# Altium project DCLASS.PrjPcb
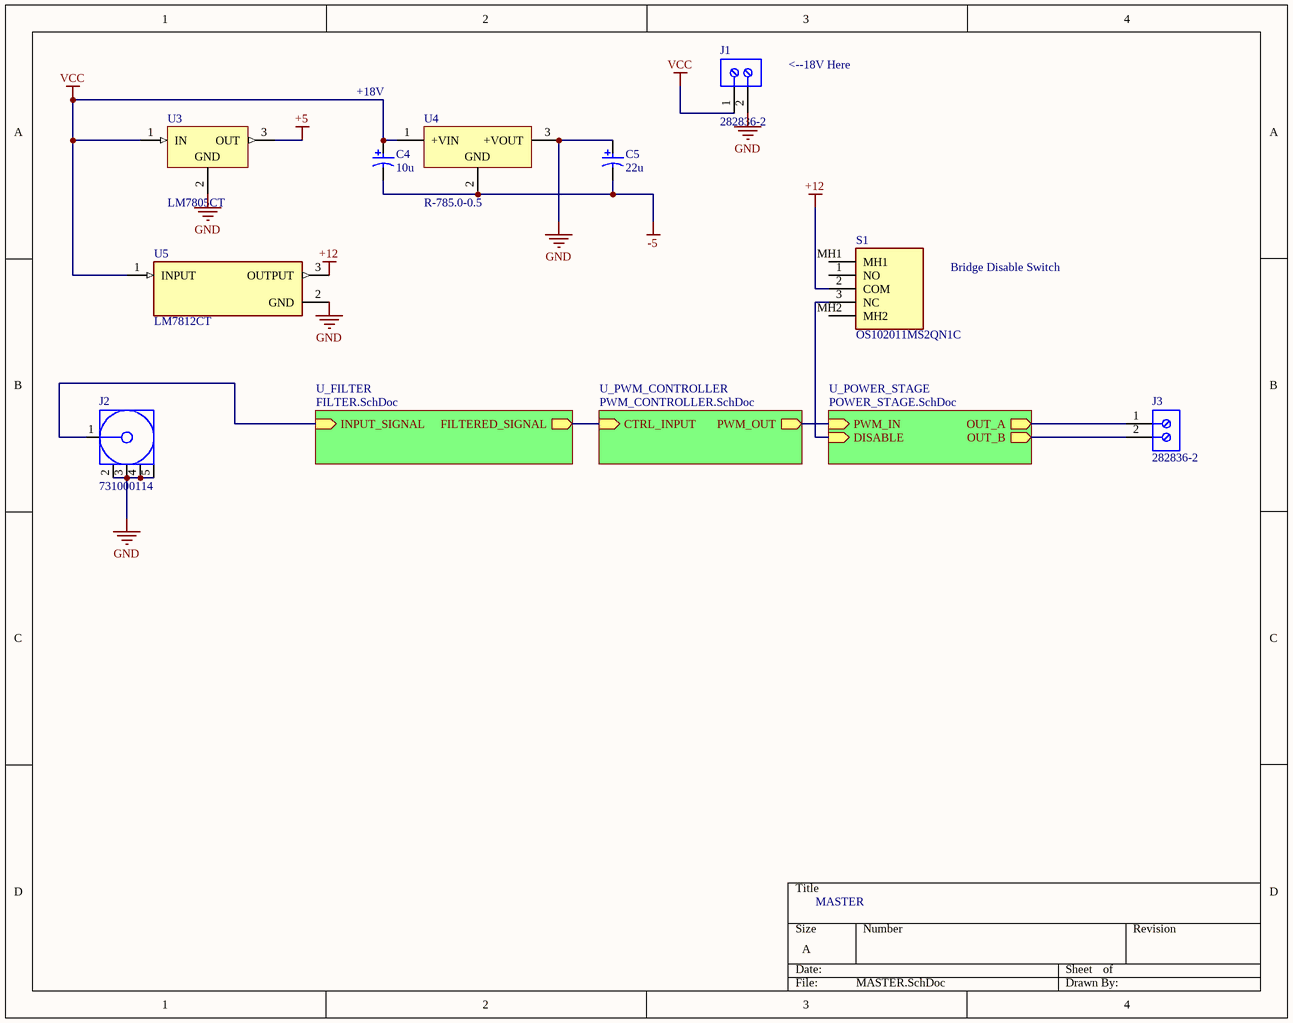
[diagram p0: MASTER.SchDoc]
4 sheets, 52 parts. Net scope: hierarchical (ports join the sheet entries above them; power ports are global).
Sheets:
  MASTER.SchDoc
    U_PWM_CONTROLLER = PWM_CONTROLLER.SchDoc
    U_FILTER = FILTER.SchDoc
    U_POWER_STAGE = POWER_STAGE.SchDoc

## Sheet MASTER.SchDoc: MASTER
size A; Author: Keshav Raj, Tim Loretto; DocumentNumber: 1; Revision: 1.0; SheetNumber: 1; SheetTotal: 4

### Parts
C4  10u  [PNSC-ECA-1VM221-2]
C5  22u  [PNSC-ECA-1VM221-2]
J1  282836-2  [TECO-282836-2_V]
J2  731000114  [MOLX-731000114_V]
J3  282836-2  [TECO-282836-2_V]
S1  OS102011MS2QN1C  [OS102011MS2QN1C]
U3  LM7805CT  [FAIR-TO-220-3]
U4  R-785.0-0.5  [REPO-R-78XX-3_V]
U5  LM7812CT  [FP-TO220B03-MFG]

### Sub-sheets
U_FILTER = FILTER.SchDoc: FILTERED_SIGNAL (out), INPUT_SIGNAL (in)
U_POWER_STAGE = POWER_STAGE.SchDoc: PWM_IN (in), DISABLE (in), OUT_A (out), OUT_B (out)
U_PWM_CONTROLLER = PWM_CONTROLLER.SchDoc: CTRL_INPUT (in), PWM_OUT (out)

### Nets
+5: U3.3(OUT)
+12: S1.2(COM) U5.3(OUTPUT)
-5: C4.2 C5.2 U4.2(GND)
GND: C5.1 J1.2 J2.2 J2.3 J2.4 J2.5 U3.2(GND) U4.3(+VOUT) U5.2(GND)
VCC: C4.1 J1.1 U3.1(IN) U4.1(+VIN) U5.1(INPUT)
B_SIDE: J3.2 ; sheet U_POWER_STAGE/OUT_B
NetC2_2: sheet U_PWM_CONTROLLER/CTRL_INPUT, sheet U_FILTER/FILTERED_SIGNAL
NetC14_1: J3.1 ; sheet U_POWER_STAGE/OUT_A
NetIC1_3: sheet U_PWM_CONTROLLER/PWM_OUT, sheet U_POWER_STAGE/PWM_IN
NetIC1_8: S1.3(NC) ; sheet U_POWER_STAGE/DISABLE
NetJ2_1: J2.1 ; sheet U_FILTER/INPUT_SIGNAL

Not connected (* = marked no-connect by the designer): S1 1(NO) MH1 MH2

### Notes on the sheet
- +18V
- (near J1) <--18V Here
- Bridge Disable Switch
- MASTER

### Library data of the parts
C4 C5 = CMP-2000-05311-1: Aluminum Electrolytic Capacitor, 220 uF, +/- 20%, 35 V, -40 to 85 degC, 2-Pin THD, RoHS, Bulk; Manufacturer: Panasonic; Lifetime@Temperature: 2000Hrs@85degC; Rated Voltage: 35V; Ripple Current: 350mA; Type: Radial; Capacitance: 220µF; Package Reference: ECA-1VM221; Series: M; Operating Temp Range: -40to+85degC; Package Description: 2-Pin Axial Lead, Dia 8 mm, Body Length 12.5 mm; Datasheet Version: Mar-06; Datasheet URL: https://datasheet.ciiva.com/26341/441851-da-01-en-elko-eca1vm221-m-r-220myf-35v-85c-26341906.pdf; Operating Temp-Max: 85degC; Case Size/Dimension: Ø8x11.5mm; Manufacturer URL: http://www.panasonic.com/
J1 J3 = CMP-1684-00017-1: Female Header, Pitch 5 mm, 1 x 2 Position, Height 10 mm, Tail Length 3.5 mm, Rohs, Bulk; Manufacturer: TE Connectivity; Wire Gauge: 16-30AWG; Product Training Modules: Wire-to-BoardEurostyleTerminalBlocks; Clamp Material - Plating: Brass-NickelPlated; Voltage: 300V; Mating Orientation: HorizontalwithBoard; Current: 13.5A; Pitch: 0.197"(5.00mm); Screw Thread: M3; 3D Model: 282836-2.pdf; Other Names: 5ULV-02B / A98076; Dynamic Catalog: BuchananSeries; Number of Levels: 1; Torque - Screw: 0.68Nm(6Lb-In); Featured Product: EurostyleTerminalBlockConnectors; Positions Per Level: 2; Wire Termination: Screw-RisingCageClamp; Datasheet URL: http://www.te.com.cn/commerce/DocumentDelivery/DDEController?Action=showdoc&DocId=Catalog+Section%7F1308389_EUROSTYLE_TERMINAL_BLOCKS%7F0607%7Fpdf%7FEnglish%7FENG_CS_1308389_EUROSTYLE_TERMINAL_BLOCKS_0607.pdf%7F282836-2; Color: Green; Family: TerminalBlocks-WiretoBoard; RoHS Information: 282836-2StatementofCompliance; Standard Package: 300; Contact Material - Plating: Brass-TinPlated; Manufacturer URL: http://www.te.com; Housing Material: Polyamide(PA66),Nylon6/6; Features: Interlocking(Side); Package Description: Female Header, Pitch 5 mm, 1 x 2 Position, Height 10 mm, Tail Length 3.5 mm; Mounting Type: ThroughHole; Package Reference: THD; Packaging: Bulk; Series: Buchanan; Category: Connectors,Interconnects; Screw Material - Plating: Brass-NickelPlated
J2 = CMP-2000-05487-1: SMA Right-Angle PCB Jack Receptacle, Brass Body, Gold Plated, 50 Ohm, 5-Pin THD, RoHS, Tray; Manufacturer: Molex; Datasheet Version: 09/2016; Package Description: 5-Pin Through Hole Device, Body 14.8 x 6.35 mm, Pitch 2.54 mm; Datasheet URL: http://www.molex.com/webdocs/datasheets/pdf/en-us/0731000114_RF_COAX_CONNECTORS.pdf; Manufacturer URL: http://www.molex.com/; Package Reference: 731000114; Mounting Technology: ThroughHole; Package URL: http://www.molex.com/pdm_docs/sd/731000114_sd.pdf
S1 = OS102011MS2QN1C: Switch; Manufacturer_Name: C & K COMPONENTS; Datasheet Link: http://uk.rs-online.com/web/p/products/1546147; Height: 8.7mm; Manufacturer_Part_Number: OS102011MS2QN1C; Arrow Part Number: OS102011MS2QN1C; Mouser Part Number: 611-OS102011MS2QN1C; Mouser Price/Stock: https://www.mouser.co.uk/ProductDetail/CK/OS102011MS2QN1C?qs=FgXbtR4Gg7KP4hs8ueQ7Wg%3D%3D
U3 = CMP-2000-04938-1: Positive Voltage Regulator, 5 V, 1 A, -40 to 125 degC, 3-Pin TO-220, RoHS, Tube; Manufacturer: FairchildSemiconductor; Maximum Input Voltage: 35V; Maximum Quiescent Current: 8mA; Load Regulation: 100mV; Maximum Output Current: 2.2(Typ)A; Output Type: Fixed; Typical Dropout Voltage @ Current: 2@1AV; Rad Hard: No; Output Voltage: 5V; Accuracy: ±4%; Number of Outputs: 1; Category: LinearRegulator; Package Description: 3-Pin Through Hole Device, Body 10 x 4.5 mm, Pitch 2.54 mm; Packaging: Rail/Tube; Mounting: ThroughHole; Polarity: Positive; Manufacturer URL: https://www.fairchildsemi.com/; Line Regulation: 100mV; Datasheet Version: Aug-12; Datasheet URL: https://datasheet.ciiva.com/26904/lm7805ct-26904988.pdf; Package Reference: TO-220; Package URL: https://www.fairchildsemi.com/package-drawings/TO/TO220B03.pdf; Package: 3TO-220AB; Operating Temperature: -40to125degC; Type: Linear
U4 = CMP-2000-05328-1: DC/DC-Converter, 5 V Single Output, 500 mA, -40 to 85 degC, 3-Pin THD, RoHS, Tube; Manufacturer: Recom Power; Input Voltage: 6.5to34V; Output Voltage: 5V; Form Factor: 11.5x7.6x14.3mm; Isolation: NonIsolated; Datasheet Version: Mar-06; Datasheet URL: https://datasheet.ciiva.com/29153/154483-da-01-en-dc-dc-wandler-innoline-r-785-0-0-5-sip3-29153550.pdf; Manufacturer URL: http://www.recom-power.com/us/americas/home.html; No of Outputs: Single; Type: Encapsulated
U5 = CMP-07128-000015-1: IC REG LINEAR 12V 1A TO220-3; Obsolete Part: true; Manufacturer: ON Semiconductor; Nominal Supply Current: 5.1mA; Output Type: Fixed; Dropout Voltage: 2V; Max Supply Voltage: 35V; Accuracy Percentage: 4%; Standoff Height: 2.7mm; Number Of Outputs: 1; Octopart: https://octopart.com/lm7812ct-on+semiconductor-14383031; Output Current: 1A; ComponentLink2Description: Datasheet; Device Class L1: Integrated Circuits (ICs); Device Class L2: Power Management ICs; Temperature Range Low: -40°C; Category: IC; Package: TO220B03; Device Class L3: Voltage Regulators - Linear; RoHS: TRUE; Digikey Description: IC REG LINEAR 12V 1A TO220-3; Ipc Land Pattern Name: TO-220; Output Voltage: 12V; Temperature: -40°C to +125°C; Automotive: No; Temperature Range High: +125°C; ComponentLink2URL: https://www.mouser.in/datasheet/2/308/LM7812-1125088.pdf; Manufacturer Part Number: LM7812CT; Height: 20.4mm; Lead Free: Yes

## Sheet PWM_CONTROLLER.SchDoc: PWM_CONTROLLER
size A
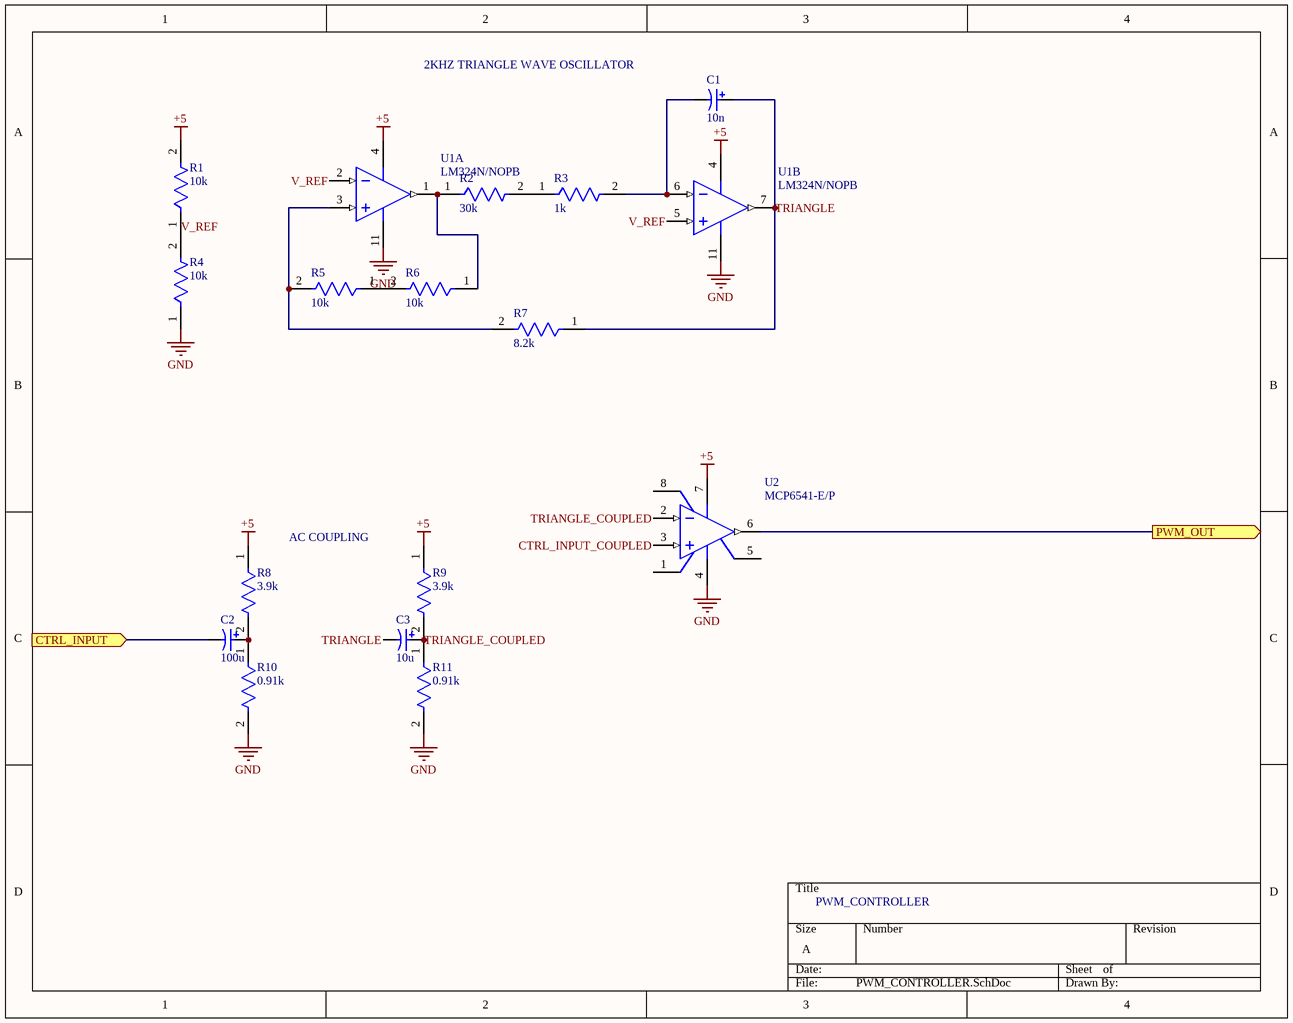
[diagram p1: PWM_CONTROLLER.SchDoc]

### Parts
C1  10n  [PNSC-ECA-1VM221-2]
C2  100u  [PNSC-ECA-1VM221-2]
C3  10u  [PNSC-ECA-1VM221-2]
R1  10k  [FP-CF18-MFG]
R2  30k  [FP-CF18-MFG]
R3  1k  [FP-CF18-MFG]
R4  10k  [FP-CF18-MFG]
R5  10k  [FP-CF18-MFG]
R6  10k  [FP-CF18-MFG]
R7  8.2k  [FP-CF18-MFG]
R8  3.9k  [FP-CF18-MFG]
R9  3.9k  [FP-CF18-MFG]
R10  0.91k  [FP-CF18-MFG]
R11  0.91k  [FP-CF18-MFG]
U1  LM324N/NOPB  [NFF0014A]  (parts A,B of 4)
U2  MCP6541-E/P  [PDIP300-P8]

### Ports
CTRL_INPUT (in), PWM_OUT (out)

### Nets
+5: R1.2 R8.1 R9.1 U1.4(V+) U2.7(VDD)
GND: R4.1 R10.2 R11.2 U1.11(GND) U2.4(VSS)
CTRL_INPUT_COUPLED: U2.3(VIN+)
TRIANGLE: C1.1 C3.2 R7.1 U1.7(OUT2)
TRIANGLE_COUPLED: C3.1 R9.2 R11.1 U2.2(VIN-)
V_REF: R1.1 R4.2 U1.2(IN1-) U1.5(IN2+)
NetC1_2: C1.2 R3.2 U1.6(IN2-)
NetC2_1: C2.1 R8.2 R10.1
NetC2_2: C2.2 ; port CTRL_INPUT
NetIC1_3: U2.6(OUT) ; port PWM_OUT
NetR2_1: R2.1 R6.1 U1.1(OUT1)
NetR2_2: R2.2 R3.1
NetR5_1: R5.1 R6.2
NetR5_2: R5.2 R7.2 U1.3(IN1+)

Not connected (* = marked no-connect by the designer): U2 1(NC) 5(NC) 8(NC)

### Notes on the sheet
- 2KHZ TRIANGLE WAVE OSCILLATOR
- AC COUPLING
- PWM_CONTROLLER

### Library data of the parts
C1-C3 = CMP-2000-05311-1: as C4 on sheet MASTER; Package Reference: ECA-1VM221; Series: M; Operating Temp Range: -40to+85degC; Package Description: 2-Pin Axial Lead, Dia 8 mm, Body Length 12.5 mm; Datasheet Version: Mar-06; Datasheet URL: https://datasheet.ciiva.com/26341/441851-da-01-en-elko-eca1vm221-m-r-220myf-35v-85c-26341906.pdf; Operating Temp-Max: 85degC; Case Size/Dimension: Ø8x11.5mm; Manufacturer URL: http://www.panasonic.com/
R1-R11 = CMP-26528-000001-1: RES 2.2K OHM 1/8W 5% CF AXIAL; Manufacturer: Stackpole Electronics Inc; Manufacturer Part Number: CF18JT2K20; Value: 2.2kΩ; Voltage Rating: 250V; Temperature Coefficient: 0/-400ppm/°C; Power Rating: 0.125W; Composition: Carbon Film; Octopart: https://octopart.com/cf18jt2k20-stackpole+electronics-19205714; Tolerance: 5%; Series: CF; Temperature Range Low: -55°C; ComponentLink2URL: https://www.seielect.com/catalog/sei-cf_cfm.pdf; Ipc Land Pattern Name: RESAD656W65L360D200; Package: CF18; Device Class L2: Resistors; Device Class L3: Through-Hole Resistors; Resistance: 2.2kΩ; Height: 2mm; Category: Res; ComponentLink2Description: Datasheet; Lead Free: Yes; Temperature Range High: +155°C; Temperature: -55°C to +155°C; RoHS: TRUE; Device Class L1: Passive Components; Digikey Description: RES 2.2K OHM 1/8W 5% CF AXIAL; Automotive: No
U1 = CMP-0055-00116-3: Low Power Quad Operational Amplifier, 14-pin MDIP, Pb-Free; Manufacturer: Texas Instruments; PowerWise: N; CompType: Amplifiers; PackageTopMarking: NSUZXYYTTE#*LM324N; RoHS: Y; PinCount: 14; ComponentLink1URL: http://www.ti.com/general/docs/lit/getliterature.tsp?genericPartNumber=LM324-N&fileType=pdf; ComponentLink1Description: Datasheet URL; PackageDescription: MDIP, .750 x .250 x.130in, 14 Lead, .100in Pitch; Code_JEDEC: MS-001-AA; Package Reference: NFF0014A
U2 = CMP-0187-00117-2: Push-Pull Output Sub-Microamp Comparator, 8-Pin PDIP, Extended Temperature; PackageReference: PDIP300-P8; DatasheetVersion: revH, Dec-2011; ComponentLink3Description: Package Specification; Code_JEDEC: MS-001; PackageVersion: revBB, Aug-2009; ComponentLink2URL: http://ww1.microchip.com/downloads/en/DeviceDoc/21696H.pdf; ComponentLink3URL: http://www.microchip.com/stellent/groups/techpub_sg/documents/packagingspec/en012702.pdf; ComponentLink2Description: Datasheet; PackageDescription: 8-Lead Plastic Dual In-Line (P) - 300 mil Body [PDIP]; ComponentLink1URL: http://www.microchip.com/; ComponentLink1Description: Manufacturer URL; RevisionNote: URLs added. DatasheetVersion updated.

## Sheet FILTER.SchDoc: FILTER
size A
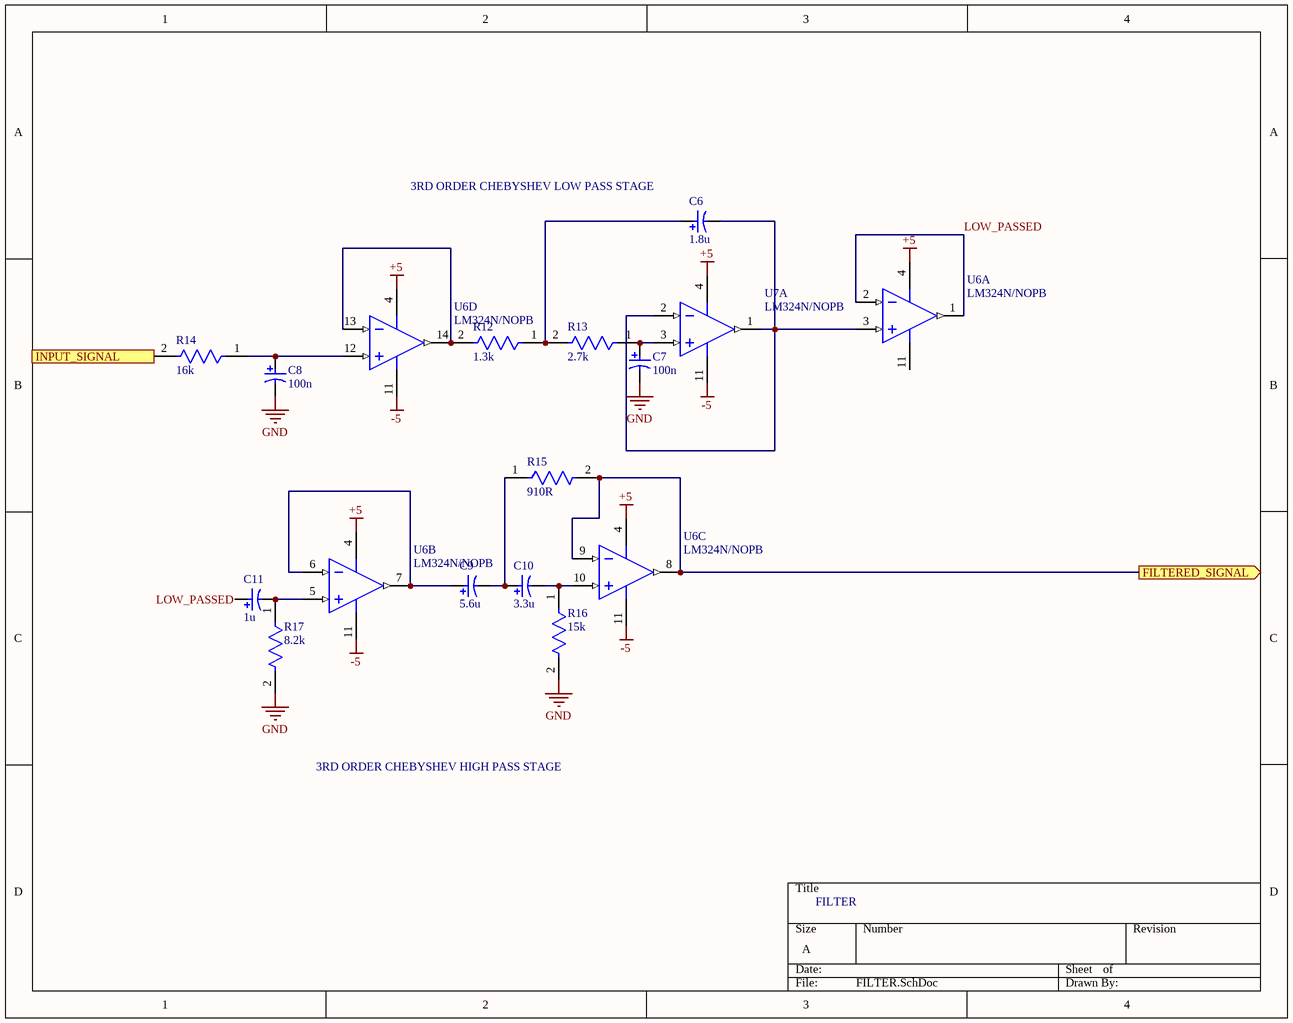
[diagram p2: FILTER.SchDoc]

### Parts
C6  1.8u  [PNSC-ECA-1VM221-2]
C7  100n  [PNSC-ECA-1VM221-2]
C8  100n  [PNSC-ECA-1VM221-2]
C9  5.6u  [PNSC-ECA-1VM221-2]
C10  3.3u  [PNSC-ECA-1VM221-2]
C11  1u  [PNSC-ECA-1VM221-2]
R12  1.3k  [FP-CF18-MFG]
R13  2.7k  [FP-CF18-MFG]
R14  16k  [FP-CF18-MFG]
R15  910R  [FP-CF18-MFG]
R16  15k  [FP-CF18-MFG]
R17  8.2k  [FP-CF18-MFG]
U6  LM324N/NOPB  [NFF0014A]  (parts A,B,C,D of 4)
U7  LM324N/NOPB  [NFF0014A]  (part A of 4)

### Ports
FILTERED_SIGNAL (out), INPUT_SIGNAL (in)

### Nets
+5: U6.4(V+) U7.4(V+)
-5: U6.11(GND) U7.11(GND)
GND: C7.2 C8.2 R16.2 R17.2
LOW_PASSED: C11.1 U6.1(OUT1) U6.2(IN1-)
NetC2_2: R15.2 U6.8(OUT3) U6.9(IN3-) ; port FILTERED_SIGNAL
NetC6_1: C6.1 R12.1 R13.2
NetC6_2: C6.2 U6.3(IN1+) U7.1(OUT1) U7.2(IN1-)
NetC7_1: C7.1 R13.1 U7.3(IN1+)
NetC8_1: C8.1 R14.1 U6.12(IN4+)
NetC9_1: C9.1 U6.6(IN2-) U6.7(OUT2)
NetC9_2: C9.2 C10.1 R15.1
NetC10_2: C10.2 R16.1 U6.10(IN3+)
NetC11_2: C11.2 R17.1 U6.5(IN2+)
NetJ2_1: R14.2 ; port INPUT_SIGNAL
NetR12_2: R12.2 U6.13(IN4-) U6.14(OUT4)

### Notes on the sheet
- 3RD ORDER CHEBYSHEV LOW PASS STAGE
- 3RD ORDER CHEBYSHEV HIGH PASS STAGE
- FILTER

### Library data of the parts
C6-C11 = CMP-2000-05311-1: as C4 on sheet MASTER; Package Reference: ECA-1VM221; Series: M; Operating Temp Range: -40to+85degC; Package Description: 2-Pin Axial Lead, Dia 8 mm, Body Length 12.5 mm; Datasheet Version: Mar-06; Datasheet URL: https://datasheet.ciiva.com/26341/441851-da-01-en-elko-eca1vm221-m-r-220myf-35v-85c-26341906.pdf; Operating Temp-Max: 85degC; Case Size/Dimension: Ø8x11.5mm; Manufacturer URL: http://www.panasonic.com/
R12-R17 = CMP-26528-000001-1: as R1 on sheet PWM_CONTROLLER; Composition: Carbon Film; Octopart: https://octopart.com/cf18jt2k20-stackpole+electronics-19205714; Tolerance: 5%; Series: CF; Temperature Range Low: -55°C; ComponentLink2URL: https://www.seielect.com/catalog/sei-cf_cfm.pdf; Ipc Land Pattern Name: RESAD656W65L360D200; Package: CF18; Device Class L2: Resistors; Device Class L3: Through-Hole Resistors; Resistance: 2.2kΩ; Height: 2mm; Category: Res; ComponentLink2Description: Datasheet; Lead Free: Yes; Temperature Range High: +155°C; Temperature: -55°C to +155°C; RoHS: TRUE; Device Class L1: Passive Components; Digikey Description: RES 2.2K OHM 1/8W 5% CF AXIAL; Automotive: No
U6 U7 = CMP-0055-00116-3: as U1 on sheet PWM_CONTROLLER; RoHS: Y; PinCount: 14; ComponentLink1URL: http://www.ti.com/general/docs/lit/getliterature.tsp?genericPartNumber=LM324-N&fileType=pdf; ComponentLink1Description: Datasheet URL; PackageDescription: MDIP, .750 x .250 x.130in, 14 Lead, .100in Pitch; Code_JEDEC: MS-001-AA; Package Reference: NFF0014A

## Sheet POWER_STAGE.SchDoc: POWER_STAGE
size A
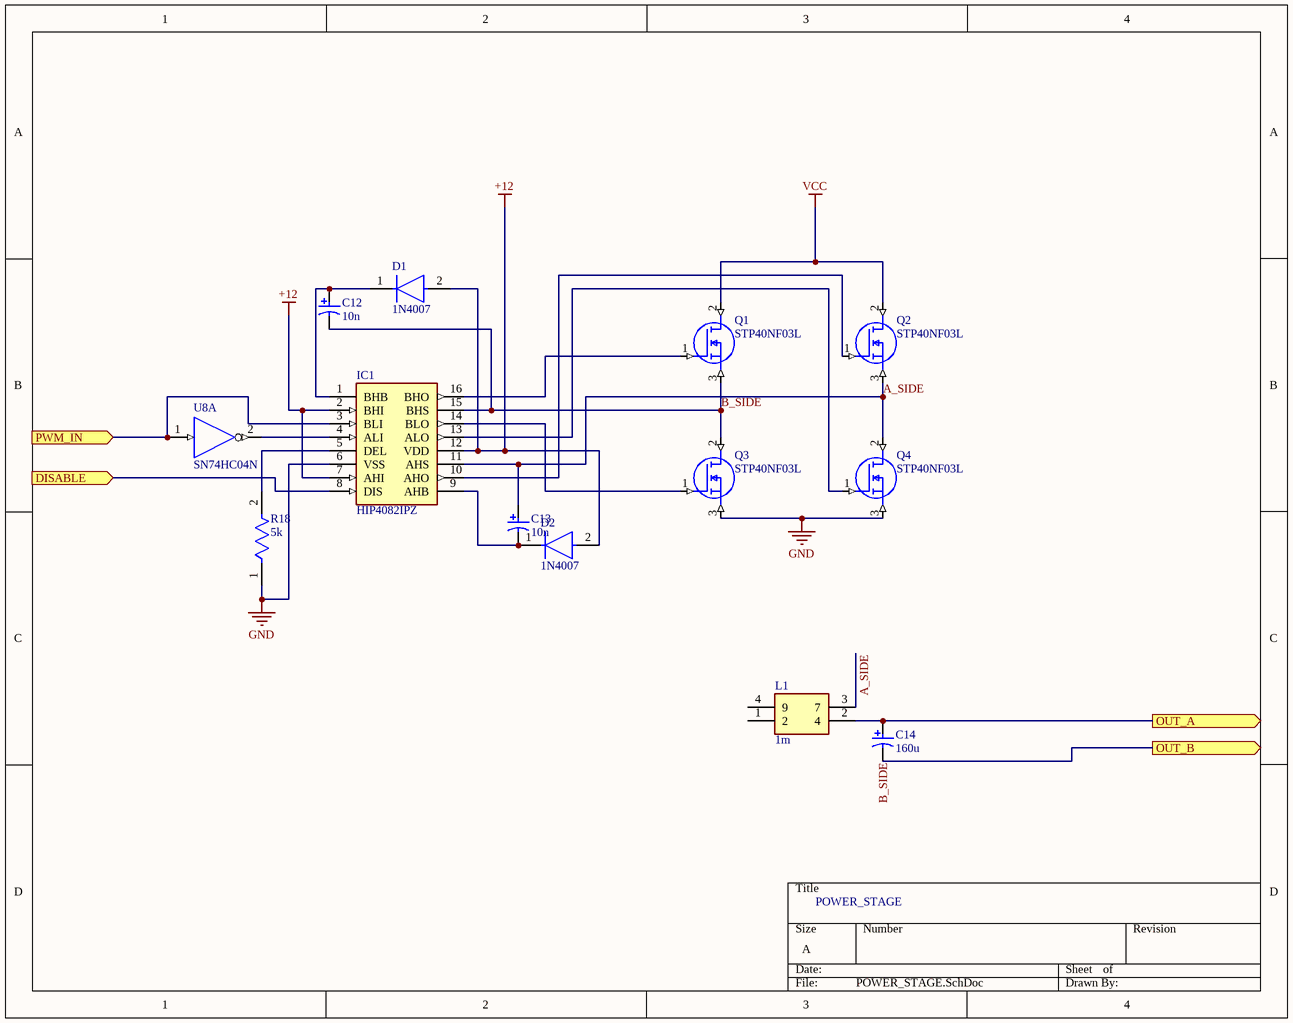
[diagram p3: POWER_STAGE.SchDoc]

### Parts
C12  10n  [PNSC-ECA-1VM221-2]
C13  10n  [PNSC-ECA-1VM221-2]
C14  160u  [PNSC-ECA-1VM221-2]
D1  1N4007  [FP-1N4007-MFG]
D2  1N4007  [FP-1N4007-MFG]
IC1  HIP4082IPZ  [DIP794W56P254L1917H533Q16N]
L1  1m  [744824101]
Q1  STP40NF03L  [TO254P470X1016X2019-3P]
Q2  STP40NF03L  [TO254P470X1016X2019-3P]
Q3  STP40NF03L  [TO254P470X1016X2019-3P]
Q4  STP40NF03L  [TO254P470X1016X2019-3P]
R18  5k  [FP-CF18-MFG]
U8  SN74HC04N  [N0014A]  (part A of 7)

### Ports
DISABLE (in), OUT_A (out), OUT_B (out), PWM_IN (in)

### Nets
+12: D1.2(A) D2.2(A) IC1.2(BHI) IC1.7(AHI) IC1.12(VDD)
GND: IC1.6(VSS) Q3.3(S) Q4.3(S) R18.1
VCC: Q1.2(D) Q2.2(D)
A_SIDE: C13.1 IC1.11(AHS) L1.3(7) Q2.3(S) Q4.2(D)
B_SIDE: C12.2 C14.2 IC1.15(BHS) Q1.3(S) Q3.2(D) ; port OUT_B
NetC12_1: C12.1 D1.1(C) IC1.1(BHB)
NetC13_2: C13.2 D2.1(C) IC1.9(AHB)
NetC14_1: C14.1 L1.2(4) ; port OUT_A
NetIC1_3: IC1.3(BLI) U8.1(1A) ; port PWM_IN
NetIC1_4: IC1.4(ALI) U8.2(~{1Y})
NetIC1_5: IC1.5(DEL) R18.2
NetIC1_8: IC1.8(DIS) ; port DISABLE
NetIC1_10: IC1.10(AHO) Q2.1(G)
NetIC1_13: IC1.13(ALO) Q4.1(G)
NetIC1_14: IC1.14(BLO) Q3.1(G)
NetIC1_16: IC1.16(BHO) Q1.1(G)

Not connected (* = marked no-connect by the designer): L1 1(2) 4(9)

### Notes on the sheet
- POWER_STAGE

### Library data of the parts
C12-C14 = CMP-2000-05311-1: as C4 on sheet MASTER; Package Reference: ECA-1VM221; Series: M; Operating Temp Range: -40to+85degC; Package Description: 2-Pin Axial Lead, Dia 8 mm, Body Length 12.5 mm; Datasheet Version: Mar-06; Datasheet URL: https://datasheet.ciiva.com/26341/441851-da-01-en-elko-eca1vm221-m-r-220myf-35v-85c-26341906.pdf; Operating Temp-Max: 85degC; Case Size/Dimension: Ø8x11.5mm; Manufacturer URL: http://www.panasonic.com/
D1 D2 = CMP-123542-000001-1: Rectifier diode 1000 V 1 A DO-41, ,; Manufacturer: Diotec; Max Surge Forward Current: 27A; Forward Current: 1A; Max Junction Temp: +175°C; Reverse Voltage: 1000V; Value: 15pF; Peak Reverse Current: 5uA; Category: Diode; Temperature Range Low: -50°C; Automotive: No; Temperature: -50°C to +175°C; Lead Free: Yes; ComponentLink2Description: Datasheet; Max Repetitive Reverse Voltage: 1000V; ComponentLink2URL: https://datasheet.octopart.com/1N4007-Diotec-datasheet-62346875.pdf; Manufacturer Part Number: 1N4007; Device Class L3: Rectifier Diodes; Height: 2.8mm; Octopart: https://octopart.com/1n4007-diotec-4040411; Package: 1N4007; Temperature Range High: +175°C; Device Class L1: Discrete Semiconductors; Device Class L2: Diodes; RoHS: TRUE; Capacitance: 15pF; Ipc Land Pattern Name: DIOAD888W100L520D280
IC1 = HIP4082IPZ: Integrated Circuit; Manufacturer_Name: Intersil; Datasheet Link: http://www.farnell.com/datasheets/1936004.pdf; Height: 5.33mm; Manufacturer_Part_Number: HIP4082IPZ; Arrow Part Number: HIP4082IPZ; Arrow Price/Stock: https://www.arrow.com/en/products/hip4082ipz/intersil; Mouser Part Number: 968-HIP4082IPZ
L1 = 744824101: Inductor; Manufacturer_Name: Wurth Elektronik; Datasheet Link: http://docs-emea.rs-online.com/webdocs/04ac/0900766b804acf50.pdf; Manufacturer_Part_Number: 744824101; Arrow Part Number: 744824101; Mouser Part Number: 710-744824101; Mouser Price/Stock: https://www.mouser.co.uk/ProductDetail/Wurth-Elektronik/744824101?qs=AXuZnX5ayYQsR%2F4Ip96LjQ%3D%3D
Q1-Q4 = FDP7030BL: MOSFET (N-Channel); Manufacturer_Name: ON Semiconductor; Datasheet Link: https://www.mouser.de/datasheet/2/308/FDP7030BL-1305790.pdf; Height: 4.7mm; Manufacturer_Part_Number: FDP7030BL; Arrow Part Number: FDP7030BL; Arrow Price/Stock: https://www.arrow.com/en/products/fdp7030bl/on-semiconductor; Mouser Part Number: 512-FDP7030BL; Mouser Price/Stock: https://www.mouser.com/Search/Refine.aspx?Keyword=512-FDP7030BL
R18 = CMP-26528-000001-1: as R1 on sheet PWM_CONTROLLER; Composition: Carbon Film; Octopart: https://octopart.com/cf18jt2k20-stackpole+electronics-19205714; Tolerance: 5%; Series: CF; Temperature Range Low: -55°C; ComponentLink2URL: https://www.seielect.com/catalog/sei-cf_cfm.pdf; Ipc Land Pattern Name: RESAD656W65L360D200; Package: CF18; Device Class L2: Resistors; Device Class L3: Through-Hole Resistors; Resistance: 2.2kΩ; Height: 2mm; Category: Res; ComponentLink2Description: Datasheet; Lead Free: Yes; Temperature Range High: +155°C; Temperature: -55°C to +155°C; RoHS: TRUE; Device Class L1: Passive Components; Digikey Description: RES 2.2K OHM 1/8W 5% CF AXIAL; Automotive: No
U8 = CMP-1615-00892-2: Hex Inverters, N0014A, TUBE; Manufacturer: Texas Instruments; VCC(Min)(V): 2; Bits(#): 6; Technology Family: HC; tpd @ Nom Voltage(Max)(ns): 20; Output Drive (IOL/IOH)(Max)(mA): -4/4; Rating: Catalog; Voltage(Nom)(V): 5; Schmitt Trigger: No; ICC @ Nom Voltage(Max)(mA): 0.02; Input Type: CMOS; Code_JEDEC: MS-001; PackageReference: N0014A; DatasheetVersion: SCLS078F; Output Type: CMOS; VCC(Max)(V): 6; Operating Temperature Range(C): -40 to 85; Generic Part Number: SN74HC04; F @ Nom Voltage(Max)(Mhz): 20

## Nets that join several sheets
+5: MASTER (U3.3), PWM_CONTROLLER (5 pins), FILTER (U6.4 U7.4)
+12: MASTER (S1.2 U5.3), POWER_STAGE (5 pins)
-5: MASTER (C4.2 C5.2 U4.2), FILTER (U6.11 U7.11)
GND: MASTER (9 pins), PWM_CONTROLLER (5 pins), FILTER (C7.2 C8.2 R16.2 R17.2), POWER_STAGE (IC1.6 Q3.3 Q4.3 R18.1)
VCC: MASTER (5 pins), POWER_STAGE (Q1.2 Q2.2)
B_SIDE: MASTER (J3.2), POWER_STAGE (5 pins)
NetC2_2: PWM_CONTROLLER (C2.2), FILTER (R15.2 U6.8 U6.9)
NetC14_1: MASTER (J3.1), POWER_STAGE (C14.1 L1.2)
NetIC1_3: PWM_CONTROLLER (U2.6), POWER_STAGE (IC1.3 U8.1)
NetIC1_8: MASTER (S1.3), POWER_STAGE (IC1.8)
NetJ2_1: MASTER (J2.1), FILTER (R14.2)